# EasyEDA Pro project ProPrj_HEMY 2.0_2025-04-23.epro, schematic HEMY Redux v2.6.5M

## Sheets
1 Logic: Board Name: TeenAstro Redux v2.6.5M; Create Date: 2025-04-08; Page Name: Logic; Project Name: HEMY 2.0; Schematic Name: Redux v2.6.5M; Update Date: 2025-04-08; Company: zUrp Astronomics; Drawed: lordzurp / polvinc; Page Size: A4; Part Number: Main Board; Reviewed: polvinc / dgedgedge; Version: v2.6.5M
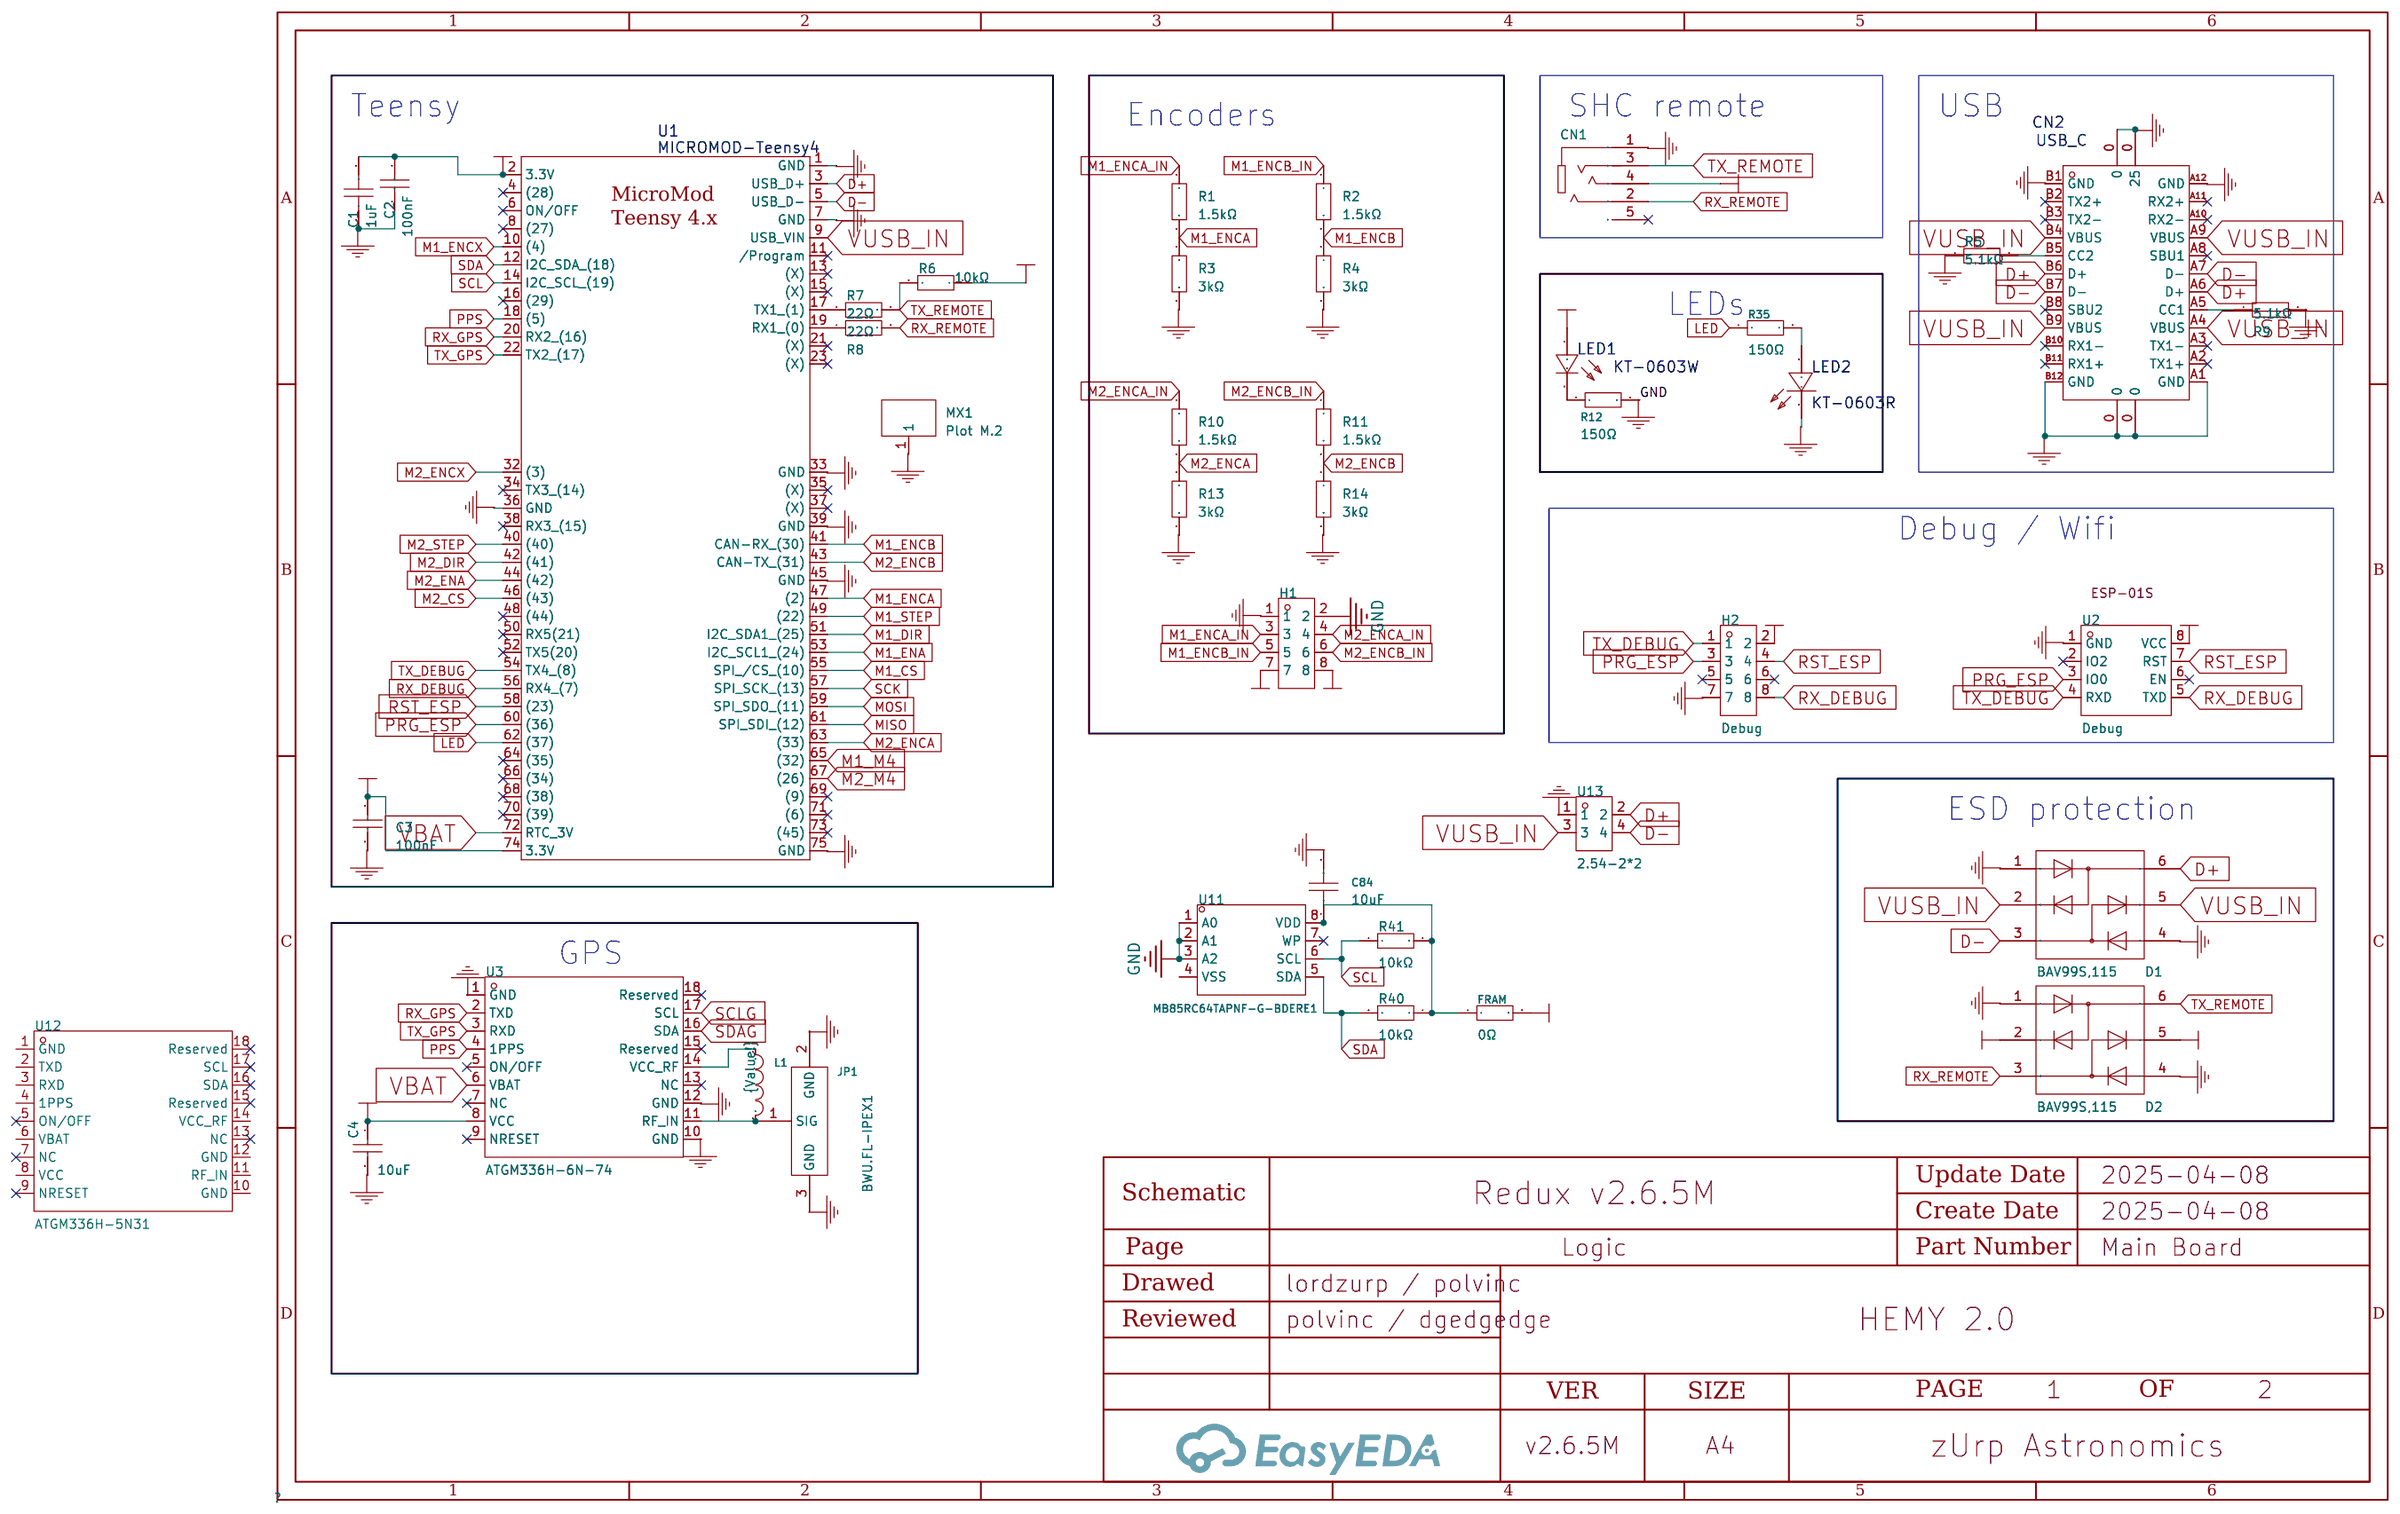
[diagram p0: Logic]
2 Power: Page Name: Power
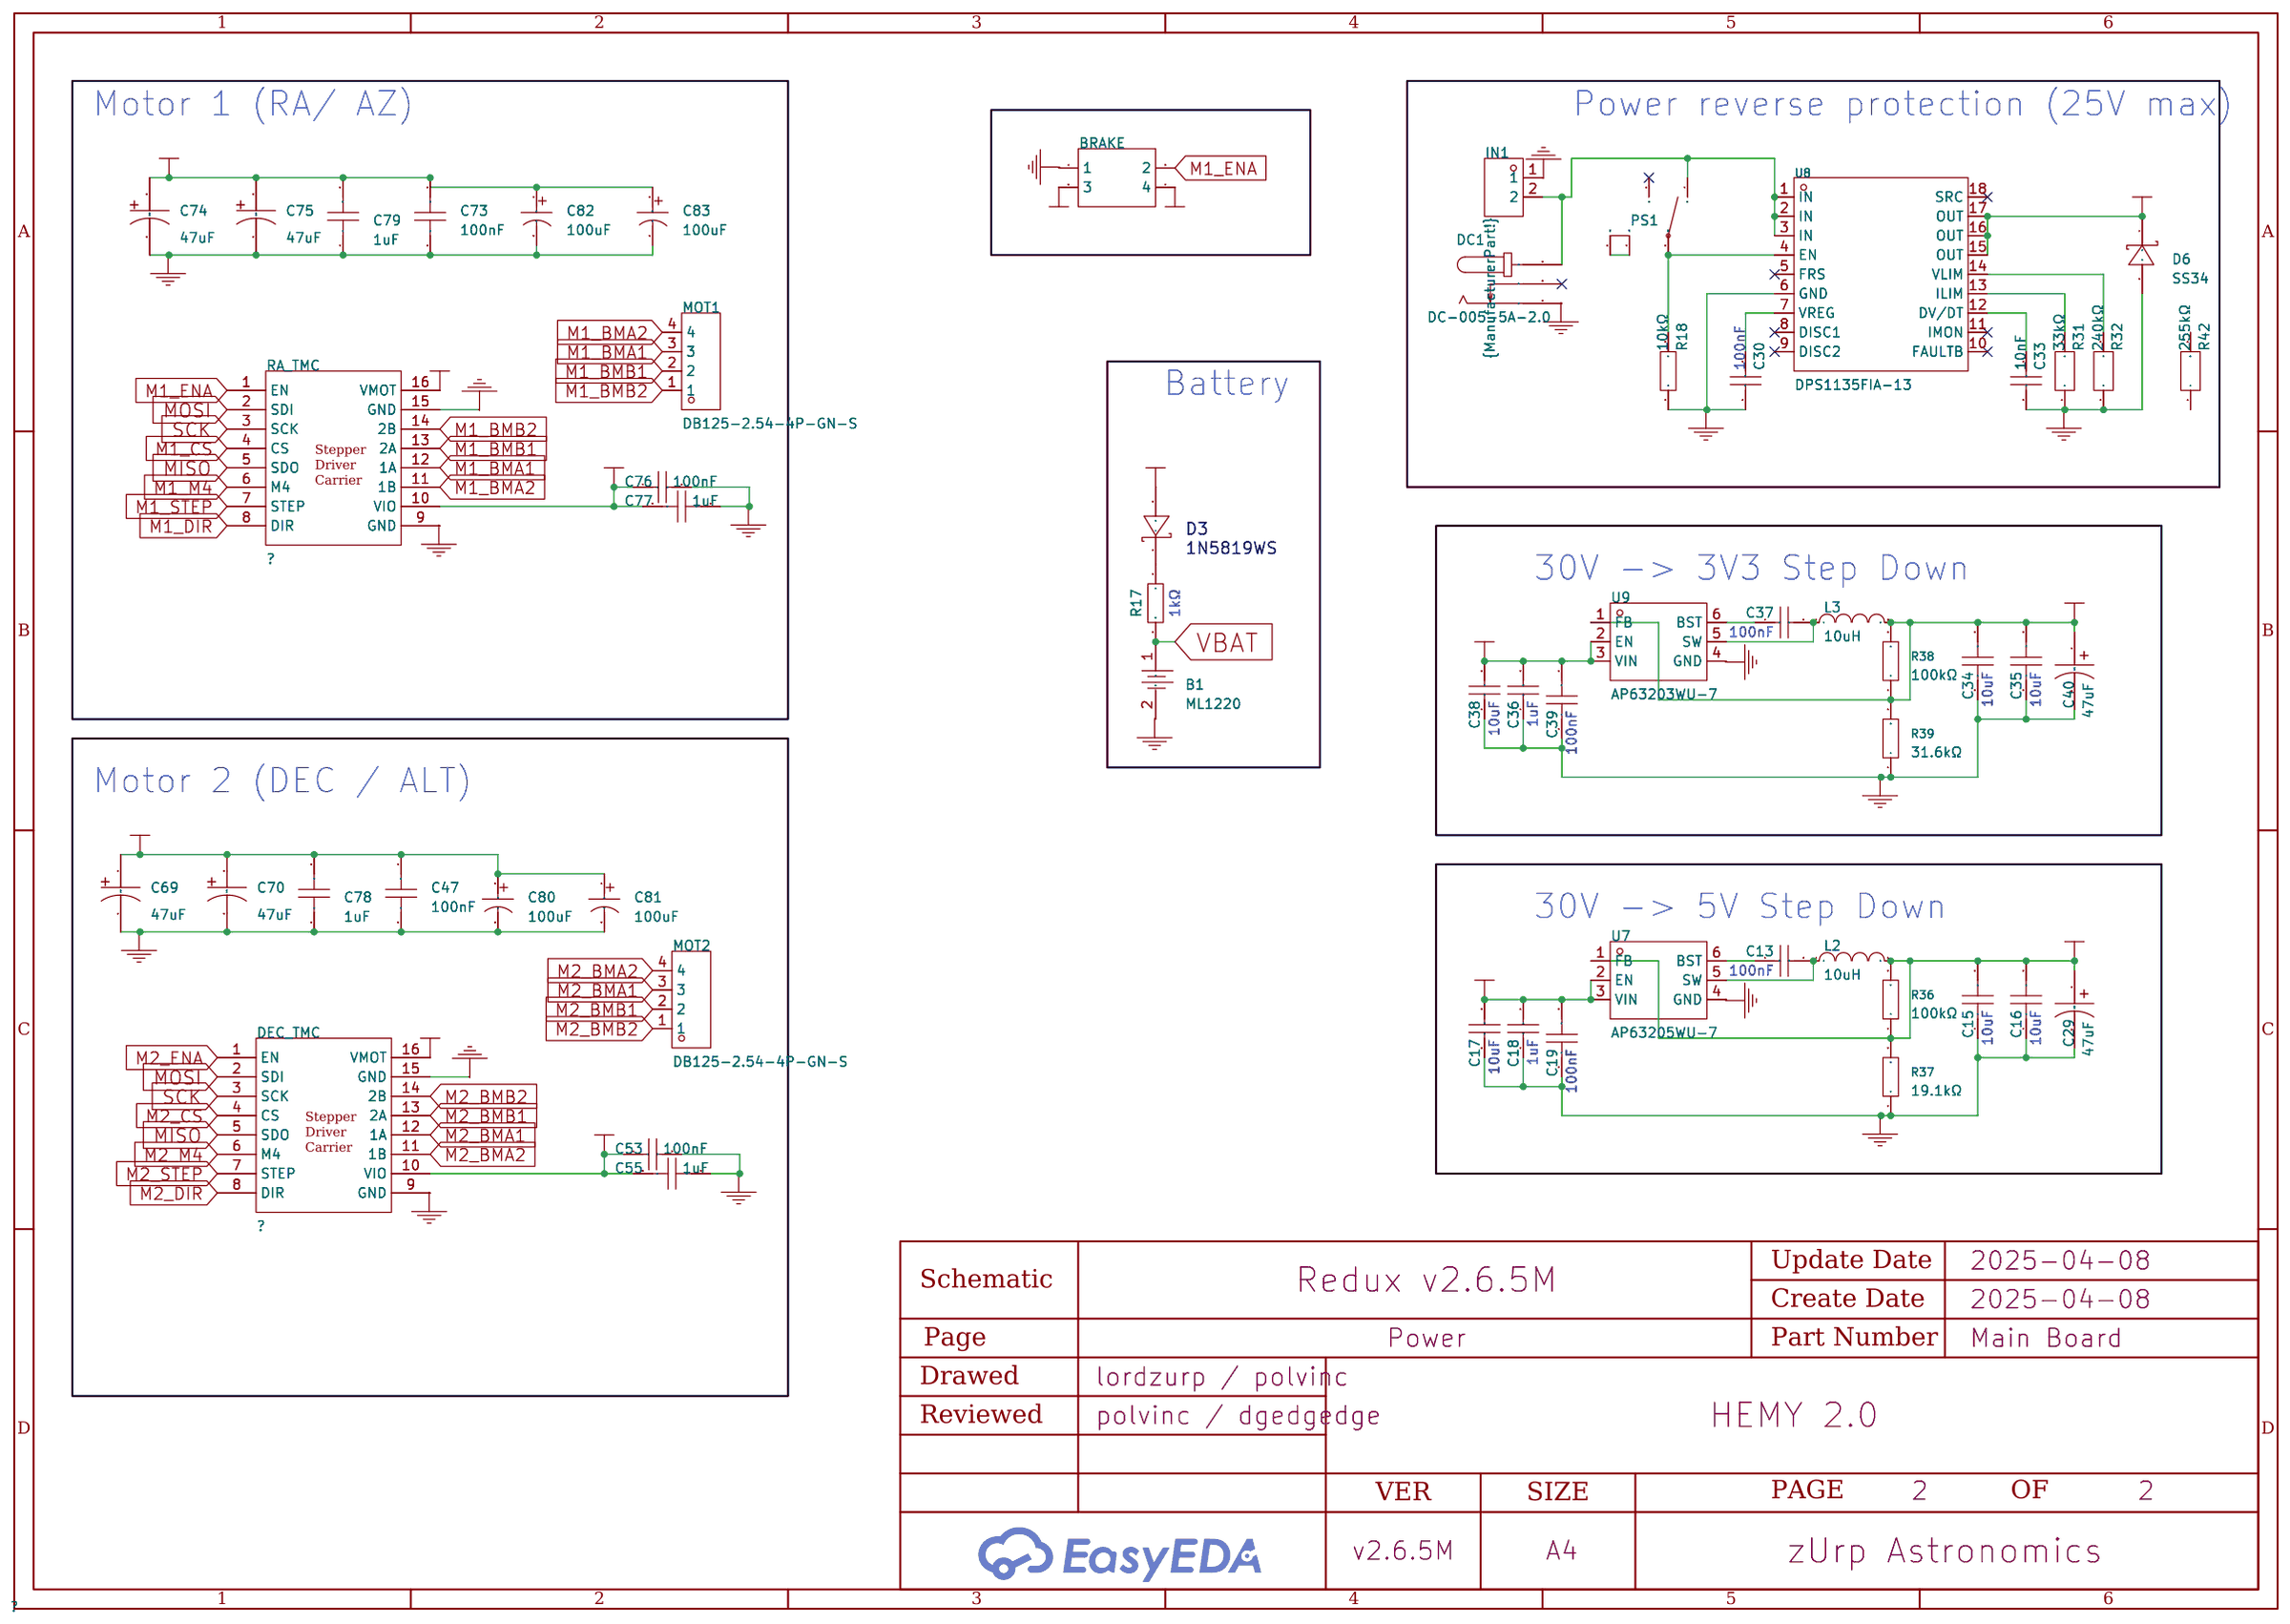
[diagram p1: Power]

## Parts
sheet Logic
C1  1uF  [C0402]
C2  100nF  [C0402]
C3  100nF  [C0402]
C4  10uF  [C0603]
C84  10uF  [C0603]
CN1  PJ-327E-SMT  [AUDIO-SMD_PJ-327E-SMT]
CN2  USB_C  [USB-C-SMD_TYPE-C-USB-18]
D1  BAV99S,115  [SOT-363_L2.0-W1.3-P0.65-LS2.1-TL]
D2  BAV99S,115  [SOT-363_L2.0-W1.3-P0.65-LS2.1-TL]
FRAM  0Ω  [R0402]
H1  DW127R-22-08-34  [HDR-TH_8P-P1.27-V-F-R2-C4-S1.27]  (no BOM)
H2  Debug  [HDR-TH_8P-P2.54-V-F-R2-C4-S2.54]  (no BOM)
JP1  BWU.FL-IPEX1  [IPEX-SMD_BWIPX-1-001E]
L1  -  [IND-SMD_L1.6-W0.8-1]
LED1  KT-0603W  [LED0603-R-RD_WHITE]
LED2  KT-0603R  [LED0603-RD]
MX1  Plot M.2  [SMD_BD5.6-D4.1]
R1  1.5kΩ  [R0603]
R2  1.5kΩ  [R0603]
R3  3kΩ  [R0603]
R4  3kΩ  [R0603]
R5  5.1kΩ  [R0603]
R6  10kΩ  [R0402]
R7  22Ω  [R0402]
R8  22Ω  [R0402]
R9  5.1kΩ  [R0603]
R10  1.5kΩ  [R0603]
R11  1.5kΩ  [R0603]
R12  150Ω  [R0603]
R13  3kΩ  [R0603]
R14  3kΩ  [R0603]
R35  150Ω  [R0603]
R40  10kΩ  [R0402]
R41  10kΩ  [R0402]
U1  MICROMOD-Teensy4  [M.2-CONNECTOR-E]
U2  2.4GHz  [WIFIM-TH_8P-L24.7-W14.4-P2.54]  (no BOM)
U3  ATGM336H-6N-74  [COMM-SMD_18P-L10.1-W9.7-P1.1-TL_L76-LB]
U11  MB85RC64TAPNF-G-BDERE1  [SOP-8_L5.0-W4.0-P1.27-LS6.0-BL]
U12  ATGM336H-5N31  [GPSM-SMD_ATGM336H-TR]  (no BOM)
U13  2.54-2*2  [HDR-TH_4P-P2.54-V-F-R2-C2-S2.54]  (no BOM)
sheet Power
B1  ML1220  [BAT-SMD_CR1220-2]  (no BOM)
BRAKE  X4621WVS-2x02I-C40D64  [HDR-SMD_4P-P2.00-V-M-R2-C2-S2.0]
C13  100nF  [C0402]
C15  10uF  [C0805]
C16  10uF  [C0805]
C17  10uF  [C1206]
C18  1uF  [C0805]
C19  100nF  [C0603]
C29  47uF  [CAP-SMD_L3.2-W1.6]
C30  100nF  [C0402]
C33  10nF  [C0402]
C34  10uF  [C0805]
C35  10uF  [C0805]
C36  1uF  [C0805]
C37  100nF  [C0402]
C38  10uF  [C1206]
C39  100nF  [C0603]
C40  47uF  [CAP-SMD_L3.2-W1.6]
C47  100nF  [C0603]
C53  100nF  [C0402]
C55  1uF  [C0402]
C69  47uF  [CAP-SMD_BD5.0-L5.3-W5.3-FD]  (no BOM)
C70  47uF  [CAP-SMD_BD5.0-L5.3-W5.3-FD]  (no BOM)
C73  100nF  [C0603]
C74  47uF  [CAP-SMD_BD5.0-L5.3-W5.3-FD]  (no BOM)
C75  47uF  [CAP-SMD_BD5.0-L5.3-W5.3-FD]  (no BOM)
C76  100nF  [C0402]
C77  1uF  [C0402]
C78  1uF  [C0603]
C79  1uF  [C0603]
C80  100uF  [CAP-TH_BD5.0-P2.00-D0.8-FD]
C81  100uF  [CAP-TH_BD5.0-P2.00-D0.8-FD]
C82  100uF  [CAP-TH_BD5.0-P2.00-D0.8-FD]
C83  100uF  [CAP-TH_BD5.0-P2.00-D0.8-FD]
D3  1N5819WS  [SOD-323_L1.8-W1.3-LS2.5-RD]
D6  SS34  [SMA_L4.3-W2.6-LS5.2-RD]
DC1  DC-005-5A-2.0  [DC-IN-TH_DC-005-5A-2.0]  (no BOM)
DEC_TMC  ?  [TMC2130 STEPPER MOTOR DRIVER CARRIER]  (no BOM)
IN1  -  [HDR-TH_2P-P2.54-V-M]  (no BOM)
L2  10uH  [IND-SMD_L2.5-W2.0_SWPA252012S]
L3  10uH  [IND-SMD_L2.5-W2.0_SWPA252012S]
MOT1  DB125-2.54-4P-GN-S  [CONN-TH_DB125-2.54-4P-GN]  (no BOM)
MOT2  DB125-2.54-4P-GN-S  [CONN-TH_DB125-2.54-4P-GN]  (no BOM)
PS1  -  [Power_switch]  (no BOM)
R17  1kΩ  [R0402]
R18  10kΩ  [R0402]
R31  33kΩ  [R0603]
R32  240kΩ  [R0603]
R36  100kΩ  [R0402]  (no BOM)
R37  19.1kΩ  [R0603]  (no BOM)
R38  100kΩ  [R0402]  (no BOM)
R39  31.6kΩ  [R0603]  (no BOM)
R42  255kΩ  [R0603]  (no BOM)
RA_TMC  ?  [TMC2130 STEPPER MOTOR DRIVER CARRIER]  (no BOM)
U7  AP63205WU-7  [TSOT-23-6_L2.9-W1.6-P0.95-LS2.8-BL]
U8  DPS1135FIA-13  [QFN-17_L4.0-W4.0-P0.50-TL-EP]
U9  AP63203WU-7  [TSOT-26_L2.9-W1.6-P0.95-LS2.8-BL]

## Library data of the parts
C1 C55 C77 = CL05A105KA5NQNC: Capacitance: Tolerance:±10% Tolerance:±10% Voltage Rated: Temperature Coefficient:; LCSC Part Name: 1uF ±10% 25V; Supplier Part: C52923; Manufacturer: SAMSUNG(三星); Supplier Footprint: 0402; JLCPCB Part Class: Basic Part; Datasheet: https://atta.szlcsc.com/upload/public/pdf/source/20160218/1457707763339.pdf; Supplier: LCSC; Tolerance: ±10%; Check: true
C2 C3 = CL05B104KO5NNNC: Capacitance: Tolerance:±10% Tolerance:±10% Voltage Rated: Temperature Coefficient:; LCSC Part Name: 100nF ±10% 16V; Supplier Part: C1525; Manufacturer: SAMSUNG(三星); Supplier Footprint: 0402; JLCPCB Part Class: Basic Part; Datasheet: https://atta.szlcsc.com/upload/public/pdf/source/20160218/1457707763339.pdf; Supplier: LCSC; Tolerance: ±10%; Check: true
C4 = GRM188R6YA106MA73D: Capacitance: Tolerance:±20% Tolerance:±20% Voltage Rated: Temperature Coefficient:; LCSC Part Name: 10uF ±20% 35V; Supplier Part: C194427; Manufacturer: muRata(村田); Supplier Footprint: 0603; JLCPCB Part Class: Extended Part; Datasheet: https://atta.szlcsc.com/upload/public/pdf/source/20210128/C194427_FCA3640823207DDB58700A82F1A19B5F.pdf; Supplier: LCSC; Tolerance: ±20%
C84 = CL10A106KP8NNNC: Capacitance: Tolerance:±10% Tolerance:±10% Voltage Rated: Temperature Coefficient:; LCSC Part Name: 10uF±10%10V; Supplier Part: C19702; Manufacturer: SAMSUNG(三星); Supplier Footprint: 0603; JLCPCB Part Class: BasicPart; Datasheet: https://atta.szlcsc.com/upload/public/pdf/source/20160103/1457707703378.pdf; Supplier: LCSC; Tolerance: ±10%
CN1 = PJ-327E-SMT: Connector Type:3.5mm耳机座 Current Rating (Max):0.5A Voltage Rating (Max):12V Operating Temperature Range:-20~+70 Operating Temperature Range:-20~+70 Welding Temperature (Max):235; LCSC Part Name: 3.5mm耳机座5P; Supplier Part: C319105; Manufacturer: XKBConnectivity(中国星坤); Supplier Footprint: SMD; JLCPCB Part Class: ExtendedPart; Datasheet: https://atta.szlcsc.com/upload/public/pdf/source/20211015/5335F6344674457D7BC015F82D74A0C2.pdf; Supplier: LCSC; Connector Type: 3.5mm耳机座; Current Rating (Max): 0.5A; Voltage Rating (Max): 12V; Operating Temperature Range: -20~+70; Welding Temperature (Max): 235; Check: true
CN2 = USB_C: JLCPCB Part Class: ExtendedPart; link: https://item.szlcsc.com/145400.html; Manufacturer: MOLEX; Manufacturer Part: 105450-0101; Supplier: LCSC; Supplier Part: C134092; Check: true
D1 D2 = BAV99S,115: Supplier Part: C96225; Manufacturer: Nexperia(安世); Supplier Footprint: SOT-363; JLCPCB Part Class: ExtendedPart; Datasheet: https://atta.szlcsc.com/upload/public/pdf/source/20170225/1488010658895.pdf; Supplier: LCSC; Check: true
FRAM = 0402WGF0000TCE: Type:Thick Film Resistors Resistance: Tolerance:±1% Tolerance:±1% Power(Watts): Overload Voltage (Max): Temperature Coefficient:±800ppm/℃ Temperature Coefficient:±800ppm/℃ Operating Temperature Range:-55℃~+155℃ Operating Temperature Range:-55℃~+155℃; LCSC Part Name: 0Ω ±1% 62.5mW 厚膜电阻; Supplier Part: C17168; Manufacturer: UNI-ROYAL(厚声); Supplier Footprint: 0402; JLCPCB Part Class: Basic Part; Datasheet: https://atta.szlcsc.com/upload/public/pdf/source/20200306/C422600_1E6D84923E4A46A82E41ADD87F860B5C.pdf; Supplier: LCSC; Type: Thick Film Resistors; Tolerance: ±1%; Temperature Coefficient: ±800ppm/℃; Operating Temperature Range: -55℃~+155℃
H1 = DW127R-22-08-34: Holes Structure:2x4P Pitch:1.27mm Row Spacing:1.27mm Circular Hole / Square Hole:Square Holes Mounting Type:Straight Number of Rows:双排 Number of Holes:8P Current Rating (Max):1A Voltage Rating (Max):- Holes Direction:Top Insulation Height:3.4mm Operating; LCSC Part Name: 间距:1.27mm 2x4P 直插; Supplier Part: C2935882; Manufacturer: DEALON(德艺隆); Supplier Footprint: 插件,P=1.27mm; JLCPCB Part Class: Extended Part; Datasheet: https://atta.szlcsc.com/upload/public/pdf/source/20211231/9A20BFE7A6FFE397B10DA1D4F064396A.pdf; Supplier: LCSC; Holes Structure: 2x4P; Pitch: 1.27mm; Row Spacing: 1.27mm; Circular Hole / Square Hole: Square Holes; Mounting Type: Straight; Number of Rows: 双排; Number of Holes: 8P; Current Rating (Max): 1A; Holes Direction: Top; Insulation Height: 3.4mm
H2 = DS1023-2*4SF11: Holes Structure:2x4P Pitch:2.54mm Row Spacing:2.54mm Mounting Type:Straight Number of Rows:双排 Number of Holes:8P Insulation Height:- Contact Material:- Contact Plating:-; LCSC Part Name: 间距:2.54mm 2x4P 直插 黑色; Supplier Part: C92271; Manufacturer: CONNFLY; Supplier Footprint: 插件,P=2.54mm; JLCPCB Part Class: Extended Part; Datasheet: https://atta.szlcsc.com/upload/public/pdf/source/20170925/C132132_1506321659018990428.pdf; Supplier: LCSC; Holes Structure: 2x4P; Pitch: 2.54mm; Row Spacing: 2.54mm; Mounting Type: Straight; Number of Rows: 双排; Number of Holes: 8P
JP1 = BWU.FL-IPEX1: Connector Type:板端 Interface Type:内针 Number of Ports:1 Interface Diameter:2mm Interface Length/Height:1.25mm Frequency-Max:6GHz RF Series:IPEX Impedance:50Ω Style:- Contact Material:- Contact Plating:- Operating Temperature Range:- Operating Temperature Ra; LCSC Part Name: 内针 IPEX; Supplier Part: C5137195; Manufacturer: BAT WIRELESS(蝙蝠无线); Supplier Footprint: SMD; JLCPCB Part Class: Extended Part; Datasheet: https://atta.szlcsc.com/upload/public/pdf/source/20220815/058ABE525AAE400925F1A3839AB872AC.pdf; Supplier: LCSC; Connector Type: 板端; Interface Type: 内针; Number of Ports: 1; Interface Diameter: 2mm; Interface Length/Height: 1.25mm; Frequency-Max: 6GHz; RF Series: IPEX; Impedance: 50Ω
L1 = LQW18AN47NJ00D: Supplier Part: C98077; Manufacturer: muRata(村田); Supplier Footprint: 0603; JLCPCB Part Class: ExtendedPart; Datasheet: https://atta.szlcsc.com/upload/public/pdf/source/20180326/C77127_CBB089AEA7AD2ECBE76B6A055087DE79.pdf; Supplier: LCSC; Check: true
LED1 = KT-0603W: Emitted Color:White; LCSC Part Name: 0603 白灯 高亮; Supplier Part: C2290; Manufacturer: KENTO; Supplier Footprint: 0603; JLCPCB Part Class: Basic Part; Datasheet: https://atta.szlcsc.com/upload/public/pdf/source/20221101/4C23D5C85BA051E44A00B833D0A41468.pdf; Supplier: LCSC; Emitted Color: White; JLCPCB SMD: Yes; link: https://lcsc.com/product-detail/Light-Emitting-Diodes-LED_Hubei-KENTO-Elec-0603-Green_C12624.html; image: //image.lceda.cn/szlcsc/C72043.jpg; Check: true
LED2 = KT-0603R: Emitted Color:红灯 Diode Configuration:- Lens Color:- Dominant Wavelength:- Dominant Wavelength:- Peak Wavelength:- Color Temperature:- Color Temperature:- Forward Current:- Power Dissipation:- Viewing Angle:- Mounting Sytle:- Operating Temperature:-40℃~+85; LCSC Part Name: 0603 红灯 高亮; Supplier Part: C2286; Manufacturer: KENTO; Supplier Footprint: 0603; JLCPCB Part Class: Basic Part; Datasheet: https://atta.szlcsc.com/upload/public/pdf/source/20160616/1466072038404.pdf; Supplier: LCSC; Emitted Color: 红灯; Operating Temperature: -40℃~+85℃; link: https://lcsc.com/product-detail/Light-Emitting-Diodes-LED_Hubei-KENTO-Elec-0603-Green_C12624.html; Check: true
MX1 = SMTSO3030CTJ: LCSC Part Name: M3贴片螺母铜镀锡铜镀锡; Supplier Part: C2915308; Manufacturer: Sinhoo(雄和远景); Supplier Footprint: M3x5.56xL3+1.53; JLCPCB Part Class: ExtendedPart; Datasheet: https://atta.szlcsc.com/upload/public/pdf/source/20211122/17CF5E24EB4D4DC090A80DE3D7DE5E21.pdf; Supplier: LCSC; Check: true
R1 R2 R10 R11 = 0603WAF1501T5E: Type:Thick Film Resistors Resistance: Tolerance:±1% Tolerance:±1% Power(Watts): Temperature Coefficient:±100ppm/℃ Temperature Coefficient:±100ppm/℃ Overload Voltage (Max): Operating Temperature Range:-55℃~+155℃ Operating Temperature Range:-55℃~+155℃; LCSC Part Name: 1.5kΩ±1%100mW; Supplier Part: C22843; Manufacturer: UNI-ROYAL(厚声); Supplier Footprint: 0603; JLCPCB Part Class: BasicPart; Datasheet: https://atta.szlcsc.com/upload/public/pdf/source/20200306/C422600_1E6D84923E4A46A82E41ADD87F860B5C.pdf; Supplier: LCSC; Type: ThickFilmResistors; Tolerance: ±1%; Temperature Coefficient: ±100ppm/℃; Operating Temperature Range: -55℃~+155℃; Check: true
R3 R4 R13 R14 = 0603WAF3001T5E: Type:Thick Film Resistors Resistance: Tolerance:±1% Tolerance:±1% Power(Watts): Temperature Coefficient:±100ppm/℃ Temperature Coefficient:±100ppm/℃ Overload Voltage (Max): Operating Temperature Range:-55℃~+155℃ Operating Temperature Range:-55℃~+155℃; LCSC Part Name: 3kΩ±1%100mW; Supplier Part: C4211; Manufacturer: UNI-ROYAL(厚声); Supplier Footprint: 0603; JLCPCB Part Class: BasicPart; Datasheet: https://atta.szlcsc.com/upload/public/pdf/source/20200306/C422600_1E6D84923E4A46A82E41ADD87F860B5C.pdf; Supplier: LCSC; Type: ThickFilmResistors; Tolerance: ±1%; Temperature Coefficient: ±100ppm/℃; Operating Temperature Range: -55℃~+155℃; Check: true
R5 R9 = 0603WAF5101T5E: Type:Thick Film Resistors Resistance:5.1kΩ Tolerance:±1% Tolerance:±1% Power(Watts): Overload Voltage (Max): Temperature Coefficient:±100ppm/℃ Temperature Coefficient:±100ppm/℃ Operating Temperature Range:-55℃~+155℃ Operating Temperature Range:-55℃~+155℃; LCSC Part Name: 5.1kΩ ±1% 100mW 厚膜电阻; Supplier Part: C23186; Manufacturer: UNI-ROYAL(厚声); Supplier Footprint: 0603; JLCPCB Part Class: Basic Part; Datasheet: https://atta.szlcsc.com/upload/public/pdf/source/20200306/C422600_1E6D84923E4A46A82E41ADD87F860B5C.pdf; Supplier: LCSC; Type: Thick Film Resistors; Tolerance: ±1%; Temperature Coefficient: ±100ppm/℃; Operating Temperature Range: -55℃~+155℃; Check: true
R6 = 0402WGF1002TCE: Type:Thick Film Resistors Resistance:10kΩ Tolerance:±1% Tolerance:±1% Power(Watts): Overload Voltage (Max): Temperature Coefficient:±100ppm/℃ Temperature Coefficient:±100ppm/℃ Operating Temperature Range:-55℃~+155℃ Operating Temperature Range:-55℃~+155℃; LCSC Part Name: 10kΩ ±1% 62.5mW 厚膜电阻; Supplier Part: C25744; Manufacturer: UNI-ROYAL(厚声); Supplier Footprint: 0402; JLCPCB Part Class: Basic Part; Datasheet: https://atta.szlcsc.com/upload/public/pdf/source/20200306/C422600_1E6D84923E4A46A82E41ADD87F860B5C.pdf; Supplier: LCSC; Type: Thick Film Resistors; Tolerance: ±1%; Temperature Coefficient: ±100ppm/℃; Operating Temperature Range: -55℃~+155℃; Check: true
R7 R8 = 0402WGF220JTCE: Type:Thick Film Resistors Resistance:22Ω Tolerance:±1% Tolerance:±1% Power(Watts): Overload Voltage (Max): Temperature Coefficient:±100ppm/℃ Temperature Coefficient:±100ppm/℃ Operating Temperature Range:-55℃~+155℃ Operating Temperature Range:-55℃~+155℃; LCSC Part Name: 22Ω ±1% 62.5mW 厚膜电阻; Supplier Part: C25092; Manufacturer: UNI-ROYAL(厚声); Supplier Footprint: 0402; JLCPCB Part Class: Basic Part; Datasheet: https://atta.szlcsc.com/upload/public/pdf/source/20200306/C422600_1E6D84923E4A46A82E41ADD87F860B5C.pdf; Supplier: LCSC; Type: Thick Film Resistors; Tolerance: ±1%; Temperature Coefficient: ±100ppm/℃; Operating Temperature Range: -55℃~+155℃; Check: true
R12 R35 = 0603WAF1500T5E: Type:Thick Film Resistors Resistance: Tolerance:±1% Tolerance:±1% Power(Watts): Overload Voltage (Max): Temperature Coefficient:±100ppm/℃ Temperature Coefficient:±100ppm/℃ Operating Temperature Range:-55℃~+155℃ Operating Temperature Range:-55℃~+155℃; LCSC Part Name: 150Ω ±1% 100mW 厚膜电阻; Supplier Part: C22808; Manufacturer: UNI-ROYAL(厚声); Supplier Footprint: 0603; JLCPCB Part Class: Basic Part; Datasheet: https://atta.szlcsc.com/upload/public/pdf/source/20200306/C422600_1E6D84923E4A46A82E41ADD87F860B5C.pdf; Supplier: LCSC; Type: Thick Film Resistors; Tolerance: ±1%; Temperature Coefficient: ±100ppm/℃; Operating Temperature Range: -55℃~+155℃
R18 R40 R41 = 0402WGF1002TCE: Type:Thick Film Resistors Resistance:10kΩ Tolerance:±1% Tolerance:±1% Power(Watts): Overload Voltage (Max): Temperature Coefficient:±100ppm/℃ Temperature Coefficient:±100ppm/℃ Operating Temperature Range:-55℃~+155℃ Operating Temperature Range:-55℃~+155℃; LCSC Part Name: 10kΩ ±1% 62.5mW 厚膜电阻; Supplier Part: C25744; Manufacturer: UNI-ROYAL(厚声); Supplier Footprint: 0402; JLCPCB Part Class: BasicPart; Datasheet: https://atta.szlcsc.com/upload/public/pdf/source/20200306/C422600_1E6D84923E4A46A82E41ADD87F860B5C.pdf; Supplier: LCSC; Type: ThickFilmResistors; Tolerance: ±1%; Temperature Coefficient: ±100ppm/℃; Operating Temperature Range: -55℃~+155℃; Check: true
U1 = MICROMOD-Teensy4: Manufacturer: Foxconn; Manufacturer Part: AS0BC21-S48BE-7H; Supplier: LCSC; Supplier Part: C2761457; Check: true
U2 = ESP-01: Frequency:2.4GHz Output Power:16dBm Output Power:16dBm Core Processor:ESP32 Support Interface:GPIO；UART Antenna Type:板载 PCB Antenna/IPEX Antenna Wireless Standard:802.11b/g/n Operating Voltage:3V~3.6V Operating Voltage:3V~3.6V Receive  Current:- Send  Cur; LCSC Part Name: 体积超小的802.11b/g/nWi-FiSOC模块; Supplier Part: C503581; Manufacturer: Ai-Thinker(安信可); Manufacturer Part: ESP-01S; JLCPCB Part Class: ExtendedPart; Datasheet: https://atta.szlcsc.com/upload/public/pdf/source/20200407/C503581_BFDAA19F4B592DB0CEE4D61B6918C625.pdf; Supplier: LCSC; Output Power: 16dBm; Core Processor: ESP32; Support Interface: GPIO；UART; Antenna Type: 板载PCBAntenna/IPEXAntenna; Wireless Standard: 802.11b/g/n; Operating Voltage: 3V~3.6V; Sensitivity: -90dBm; Operating Temperature: -20℃~+85℃; Check: true
U3 = ATGM336H-6N-74: Supplier Part: C5804601; Manufacturer: 杭州中科微; Supplier Footprint: SMD,10.1x9.7mm; JLCPCB Part Class: Extended Part; Datasheet: https://atta.szlcsc.com/upload/public/pdf/source/20230620/6B4557DC589EF72A5E0A00DF964910CB.pdf; Supplier: LCSC
U11 = MB85RC64TAPNF-G-BDERE1: Supplier Part: C189804; Manufacturer: RAMXEED/FUJITSU(富士通); Supplier Footprint: SOP-8; JLCPCB Part Class: Extended Part; Datasheet: https://atta.szlcsc.com/upload/public/pdf/source/20180403/C189905_A8E0CA722DC8D83A10C1D27357EA684E.pdf; Supplier: LCSC
U12 = ATGM336H-5N31: LCSC Part Name: BDS/GNSS全星座定位导航模块; Supplier Part: C90770; Manufacturer: 杭州中科微; Supplier Footprint: SMD,9.7x10.1mm; JLCPCB Part Class: ExtendedPart; Datasheet: https://atta.szlcsc.com/upload/public/pdf/source/20161226/1482720799860.pdf; Supplier: LCSC; Check: true
U13 = 2.54-2*2: Holes Structure:2x2P Pitch:2.54mm Row Spacing:2.54mm Circular Hole / Square Hole:Square Holes Mounting Type:Straight Number of Rows:双排 Number of Holes:4P Current Rating (Max):2.5A Voltage Rating (Max):- Holes Direction:Top Insulation Height:8.5mm Operatin; LCSC Part Name: 间距:2.54mm 2x2P 直插; Supplier Part: C2977590; Manufacturer: ZHOURI(洲日); Supplier Footprint: 插件,P=2.54mm; JLCPCB Part Class: Extended Part; Datasheet: https://atta.szlcsc.com/upload/public/pdf/source/20220328/0DEB63D734370D90CA736158671615A0.pdf; Supplier: LCSC; Holes Structure: 2x2P; Pitch: 2.54mm; Row Spacing: 2.54mm; Circular Hole / Square Hole: Square Holes; Mounting Type: Straight; Number of Rows: 双排; Number of Holes: 4P; Current Rating (Max): 2.5A; Holes Direction: Top; Insulation Height: 8.5mm; Operating Temperature Range: -40℃~+105℃
B1 = CR1220-2: Connector Type:Battery base Battery Type:CR1220 Operating Temperature Range:- Operating Temperature Range:-; LCSC Part Name: 电池底座适用电池:CR1220; Supplier Part: C70381; Manufacturer: Q&J; Supplier Footprint: SMD; JLCPCB Part Class: ExtendedPart; Datasheet: https://atta.szlcsc.com/upload/public/pdf/source/20160427/1461725216696.pdf; Supplier: LCSC; Connector Type: Batterybase; Battery Type: CR1220; Check: true
BRAKE = X4621WVS-2x02I-C40D64: Pin Structure:2x2P Pitch:2mm Row Spacing:2mm Circluar Pins/Square Pins:Square Pins Mounting Type:- Number of Rows:双排 Number of Pins:4P Current Rating (Max):2A Voltage Rating (Max):250V Length of Mating Pin:- Insulation Height:2mm Length of End Connection; LCSC Part Name: 2x2P 间距:2mm 方针; Supplier Part: C917607; Manufacturer: XKB Connection(中国星坤); Supplier Footprint: SMD,P=2mm; JLCPCB Part Class: Extended Part; Datasheet: https://atta.szlcsc.com/upload/public/pdf/source/20211011/BBC0D112400A54BA7413419DECD38CC2.pdf; Supplier: LCSC; Pin Structure: 2x2P; Pitch: 2mm; Row Spacing: 2mm; Circluar Pins/Square Pins: Square Pins; Number of Rows: 双排; Number of Pins: 4P; Current Rating (Max): 2A; Voltage Rating (Max): 250V; Insulation Height: 2mm; Contact Plating: Gold; Operating Temperature Range: -40℃~+105℃; Soldering Temperature(Max): 260℃; Color: Black
C13 C30 C37 C53 C76 = CL05B104KO5NNNC: Capacitance: Tolerance:±10% Tolerance:±10% Voltage Rated: Temperature Coefficient:; LCSC Part Name: 100nF±10%16V; Supplier Part: C1525; Manufacturer: SAMSUNG(三星); Supplier Footprint: 0402; JLCPCB Part Class: BasicPart; Datasheet: https://atta.szlcsc.com/upload/public/pdf/source/20160218/1457707763339.pdf; Supplier: LCSC; Tolerance: ±10%; Check: true
C15 C16 C34 C35 = CL21A106KAYNNNE_C15850: Capacitance: Tolerance:±10% Tolerance:±10% Voltage Rated: Temperature Coefficient:; LCSC Part Name: 10uF ±10% 25V; Supplier Part: C15850; Manufacturer: SAMSUNG(三星); Manufacturer Part: CL21A106KAYNNNE; Supplier Footprint: 0805; JLCPCB Part Class: Basic Part; Datasheet: https://atta.szlcsc.com/upload/public/pdf/source/20160218/1457707763339.pdf; Supplier: LCSC; Tolerance: ±10%
C17 C38 = CL31A106KBHNNNE: Capacitance: Tolerance:±10% Tolerance:±10% Voltage Rated: Temperature Coefficient:; LCSC Part Name: 10uF ±10% 50V; Supplier Part: C13585; Manufacturer: SAMSUNG(三星); Supplier Footprint: 1206; JLCPCB Part Class: Basic Part; Datasheet: https://atta.szlcsc.com/upload/public/pdf/source/20160218/1457707763339.pdf; Supplier: LCSC; Tolerance: ±10%; Check: true
C18 C36 = CL21B105KBFNNNE: Capacitance: Tolerance:±10% Tolerance:±10% Voltage Rated: Temperature Coefficient:; LCSC Part Name: 1uF ±10% 50V; Supplier Part: C28323; Manufacturer: SAMSUNG(三星); Supplier Footprint: 0805; JLCPCB Part Class: Basic Part; Datasheet: https://atta.szlcsc.com/upload/public/pdf/source/20160218/1457707763339.pdf; Supplier: LCSC; Tolerance: ±10%; Check: true
C19 C39 C47 C73 = CC0603KRX7R9BB104: Capacitance: Tolerance:±10% Tolerance:±10% Voltage Rated: Temperature Coefficient:; LCSC Part Name: 100nF±10%50V; Supplier Part: C14663; Manufacturer: YAGEO(国巨); Supplier Footprint: 0603; JLCPCB Part Class: BasicPart; Datasheet: https://atta.szlcsc.com/upload/public/pdf/source/20180910/C282072_33301C7F631E79921B82A8DAC6BCC5B3.pdf; Supplier: LCSC; Tolerance: ±10%; Check: true
C29 C40 = CA45-A-10V-47uF-M: Capacitance: Tolerance:±20% Tolerance:±20% Rated Voltage: Equivalent Series Resistance(ESR):4Ω@100kHz Operating Temperature:-55℃~+125℃ Operating Temperature:-55℃~+125℃; LCSC Part Name: 47uF ±20% 10V; Supplier Part: C688949; Manufacturer: CEC(振华新云); Supplier Footprint: CASE-A-3216; JLCPCB Part Class: Extended Part; Datasheet: https://atta.szlcsc.com/upload/public/pdf/source/20200701/C688947_CFA6E56082A981E438B337581FD21AD9.pdf; Supplier: LCSC; Tolerance: ±20%; Equivalent Series Resistance(ESR): 4Ω@100kHz; Operating Temperature: -55℃~+125℃
C33 = CL05B103KB5NNNC: Capacitance: Tolerance:±10% Tolerance:±10% Voltage Rated: Temperature Coefficient:; LCSC Part Name: 10nF ±10% 50V; Supplier Part: C15195; Manufacturer: SAMSUNG(三星); Supplier Footprint: 0402; JLCPCB Part Class: Basic Part; Datasheet: https://atta.szlcsc.com/upload/public/pdf/source/20160218/1457707763339.pdf; Supplier: LCSC; Tolerance: ±10%
C69 C70 C74 C75 = EEEFT1V470AR_C193627: Capacitance: Tolerance:±20% Tolerance:±20% Rated Voltage: Ripple Current:240mA@100kHz Equivalent Series Resistance(ESR):360mΩ@100kHz φD: L: Lifetime @ Temp:2000hrs@105℃ Operating Temperature:-55℃~+105℃ Operating Temperature:-55℃~+105℃; LCSC Part Name: 47uF ±20% 35V; Supplier Part: C193627; Manufacturer: PANASONIC(松下); Manufacturer Part: EEEFT1V470AR; Supplier Footprint: SMD,D5xL5.8mm; JLCPCB Part Class: Extended Part; Datasheet: https://atta.szlcsc.com/upload/public/pdf/source/20180607/C193627_6FE5DFF204FFC953F0DC145BA6F69CE8.pdf; Supplier: LCSC; Tolerance: ±20%; Ripple Current: 240mA@100kHz; Equivalent Series Resistance(ESR): 360mΩ@100kHz; Lifetime @ Temp: 2000hrs@105℃; Operating Temperature: -55℃~+105℃
C78 C79 = CGA0603X5R105K350JT: Capacitance:1uF Tolerance:±10% Tolerance:±10% Voltage Rated: Temperature Coefficient:; LCSC Part Name: 1uF ±10% 35V; Supplier Part: C6119865; Manufacturer: HRE(芯声); Supplier Footprint: 0603; JLCPCB Part Class: Extended Part; Supplier: LCSC; Tolerance: ±10%
C80-C83 = KM107M025D11RR0VH2FP0: Capacitance:100uF Tolerance:±20% Tolerance:±20% Rated Voltage: Ripple Current:100mA@120Hz Equivalent Series Resistance(ESR):- Lead Spacing: φD: L: Lifetime @ Temp:1000hrs@105℃; LCSC Part Name: 100uF ±20% 25V; Supplier Part: C47873; Manufacturer: CX(承兴); Supplier Footprint: 插件,D5xL11mm; JLCPCB Part Class: Extended Part; Datasheet: https://atta.szlcsc.com/upload/public/pdf/source/20211027/06D6BA3719C264B639DC286D935D03EA.pdf; Supplier: LCSC; Tolerance: ±20%; Ripple Current: 100mA@120Hz; Lifetime @ Temp: 1000hrs@105℃
D3 = 1N5819WS_C191023: Forward Voltage (Vf@If):600mV@1A Reverse Voltage (Vr):40V Average Rectified Current (Io):1A; LCSC Part Name: 电压:40V 电流:1A; Supplier Part: C191023; Manufacturer: Hottech(合科泰); Supplier Footprint: SOD-323; JLCPCB Part Class: Basic Part; Datasheet: https://atta.szlcsc.com/upload/public/pdf/source/20220428/3CB86FD8D28D653594B4E35F9D5AEFD9.pdf; Supplier: LCSC; Forward Voltage (Vf@If): 600mV@1A; Reverse Voltage (Vr): 40V; Average Rectified Current (Io): 1A
D6 = SS34_C8678: Diode Configuration:Single Forward Voltage (Vf@If):550mV@3A Reverse Voltage (Vr):40V Rectified Current:3A Reverse Leakage Current (Ir):500uA@40V; LCSC Part Name: 电压:40V 电流:3A; Supplier Part: C8678; Manufacturer: MDD(辰达半导体); Supplier Footprint: SMA(DO-214AC); JLCPCB Part Class: Basic Part; Datasheet: https://atta.szlcsc.com/upload/public/pdf/source/20230314/A80AE34493C69B89E2F4B1712F433538.pdf; Supplier: LCSC; Diode Configuration: Single; Forward Voltage (Vf@If): 550mV@3A; Reverse Voltage (Vr): 40V; Rectified Current: 3A; Reverse Leakage Current (Ir): 500uA@40V
DC1 = DC-005-5A-2.0: Connector Type:DC Power Receptacle Mounting Style:Bend insert Inside Contact Diameter:2mm Outside Contact Diameter:6.2mm Current Rating (Max):5A Voltage Rating (Max):24V Operating Temperature Range:-20℃~+70℃ Operating Temperature Range:-20℃~+70℃; LCSC Part Name: DC电源插座 内径:2mm 外径:6.2mm; Supplier Part: C381116; Manufacturer: XKB Connection(中国星坤); Supplier Footprint: 插件; JLCPCB Part Class: Extended Part; Datasheet: https://atta.szlcsc.com/upload/public/pdf/source/20211015/707A35F7AB6E89C57AAB641950105BB7.pdf; Supplier: LCSC; Connector Type: DC Power Receptacle; Mounting Style: Bend insert; Inside Contact Diameter: 2mm; Outside Contact Diameter: 6.2mm; Current Rating (Max): 5A; Voltage Rating (Max): 24V; Operating Temperature Range: -20℃~+70℃
DEC_TMC RA_TMC = TMC2130 Stepper Motor Driver Carrier
IN1 = HEAD2: Supplier Part: C9900010030; Supplier Footprint: HDR-TH_2P-P2.54; JLCPCB Part Class: ExtendedPart; Datasheet: https://atta.szlcsc.comnull; Supplier: LCSC; Check: true
L2 L3 = SWPA252012S100MT: Inductance: Tolerance:±20% Tolerance:±20% Rated Current: Saturation Current (Isat):880mA DC Resistance (DCR): Type:- Ratings:-; LCSC Part Name: 10uH ±20% 880mA; Supplier Part: C37428; Manufacturer: Sunlord(顺络); Supplier Footprint: 1008; JLCPCB Part Class: Extended Part; Datasheet: https://atta.szlcsc.com/upload/public/pdf/source/20231024/317626D2AA2F8AB4113C1875E432E6E1.pdf; Supplier: LCSC; Tolerance: ±20%; Saturation Current (Isat): 880mA
MOT1 MOT2 = DB125-2.54-4P-GN-S: Structure:1x4P Pitch:2.54mm Color:Green Mounting Style:Straight Current Rating (Max):8A Voltage Rating (Max):130V Number of Pins:4P Number of Rows:1 Wire Gauge - AWG:18~26 Wire Gauge - AWG:18~26 Wire Gauge - mm2:0.5~1 Wire Gauge - mm2:0.5~1 Number of PINs; LCSC Part Name: 2.54mm 1x4P 排数:1 每排P数:4 直插; Supplier Part: C918122; Manufacturer: DORABO(地博电气); Supplier Footprint: 插件,P=2.54mm; JLCPCB Part Class: Extended Part; Datasheet: https://atta.szlcsc.com/upload/public/pdf/source/20230106/BCD3A0BE1EB95DC3E813F1745F022035.pdf; Supplier: LCSC; Structure: 1x4P; Pitch: 2.54mm; Color: Green; Mounting Style: Straight; Current Rating (Max): 8A; Voltage Rating (Max): 130V; Number of Pins: 4P; Number of Rows: 1; Wire Gauge - AWG: 18~26; Wire Gauge - mm2: 0.5~1; Number of PINs Per Row: 4; Operating Temperature Range: -40℃~+105℃
PS1 = Power_Switch: farnell 15502274US1R102M7RN; Manufacturer Part: 4US1R102M7RN; Manufacturer: MULTICOMP PRO; Supplier Part: 1550227; Supplier: Farnell; Check: true
R17 = 0402WGF1001TCE: Type:Thick Film Resistors Resistance:1kΩ Tolerance:±1% Tolerance:±1% Power(Watts): Overload Voltage (Max): Temperature Coefficient:±100ppm/℃ Temperature Coefficient:±100ppm/℃ Operating Temperature Range:-55℃~+155℃ Operating Temperature Range:-55℃~+155℃; LCSC Part Name: 1kΩ ±1% 62.5mW 厚膜电阻; Supplier Part: C11702; Manufacturer: UNI-ROYAL(厚声); Supplier Footprint: 0402; JLCPCB Part Class: Basic Part; Datasheet: https://atta.szlcsc.com/upload/public/pdf/source/20200306/C422600_1E6D84923E4A46A82E41ADD87F860B5C.pdf; Supplier: LCSC; Type: Thick Film Resistors; Tolerance: ±1%; Temperature Coefficient: ±100ppm/℃; Operating Temperature Range: -55℃~+155℃
R31 = 0603WAF3302T5E: Type:Thick Film Resistors Resistance:33kΩ Tolerance:±1% Tolerance:±1% Power(Watts): Overload Voltage (Max): Temperature Coefficient:±100ppm/℃ Temperature Coefficient:±100ppm/℃ Operating Temperature Range:-55℃~+155℃ Operating Temperature Range:-55℃~+155℃; LCSC Part Name: 33kΩ ±1% 100mW 厚膜电阻; Supplier Part: C4216; Manufacturer: UNI-ROYAL(厚声); Supplier Footprint: 0603; JLCPCB Part Class: Basic Part; Datasheet: https://atta.szlcsc.com/upload/public/pdf/source/20200306/C422600_1E6D84923E4A46A82E41ADD87F860B5C.pdf; Supplier: LCSC; Type: Thick Film Resistors; Tolerance: ±1%; Temperature Coefficient: ±100ppm/℃; Operating Temperature Range: -55℃~+155℃
R32 = 0603WAF2403T5E: Type:Thick Film Resistors Resistance:240kΩ Tolerance:±1% Tolerance:±1% Power(Watts): Overload Voltage (Max): Temperature Coefficient:±100ppm/℃ Temperature Coefficient:±100ppm/℃ Operating Temperature Range:-55℃~+155℃ Operating Temperature Range:-55℃~+155℃; LCSC Part Name: 240kΩ ±1% 100mW 厚膜电阻; Supplier Part: C4197; Manufacturer: UNI-ROYAL(厚声); Supplier Footprint: 0603; JLCPCB Part Class: Extended Part; Datasheet: https://atta.szlcsc.com/upload/public/pdf/source/20200306/C422600_1E6D84923E4A46A82E41ADD87F860B5C.pdf; Supplier: LCSC; Type: Thick Film Resistors; Tolerance: ±1%; Temperature Coefficient: ±100ppm/℃; Operating Temperature Range: -55℃~+155℃
R36 R38 = 0402WGF1003TCE: Type:Thick Film Resistors Resistance:100kΩ Tolerance:±1% Tolerance:±1% Power(Watts): Overload Voltage (Max): Temperature Coefficient:±100ppm/℃ Temperature Coefficient:±100ppm/℃ Operating Temperature Range:-55℃~+155℃ Operating Temperature Range:-55℃~+155℃; LCSC Part Name: 100kΩ ±1% 62.5mW 厚膜电阻; Supplier Part: C25741; Manufacturer: UNI-ROYAL(厚声); Supplier Footprint: 0402; JLCPCB Part Class: Basic Part; Datasheet: https://atta.szlcsc.com/upload/public/pdf/source/20200306/C422600_1E6D84923E4A46A82E41ADD87F860B5C.pdf; Supplier: LCSC; Type: Thick Film Resistors; Tolerance: ±1%; Temperature Coefficient: ±100ppm/℃; Operating Temperature Range: -55℃~+155℃
R37 = 0603WAF1912T5E: Type:Thick Film Resistors Resistance:19.1kΩ Tolerance:±1% Tolerance:±1% Power(Watts): Overload Voltage (Max): Temperature Coefficient:±100ppm/℃ Temperature Coefficient:±100ppm/℃ Operating Temperature Range:-55℃~+155℃ Operating Temperature Range:-55℃~+155℃; LCSC Part Name: 19.1kΩ ±1% 100mW 厚膜电阻; Supplier Part: C22897; Manufacturer: UNI-ROYAL(厚声); Supplier Footprint: 0603; JLCPCB Part Class: Extended Part; Datasheet: https://atta.szlcsc.com/upload/public/pdf/source/20200306/C422600_1E6D84923E4A46A82E41ADD87F860B5C.pdf; Supplier: LCSC; Type: Thick Film Resistors; Tolerance: ±1%; Temperature Coefficient: ±100ppm/℃; Operating Temperature Range: -55℃~+155℃
R39 = 0603WAF3162T5E: Type:Thick Film Resistors Resistance:31.6kΩ Tolerance:±1% Tolerance:±1% Power(Watts): Overload Voltage (Max): Temperature Coefficient:±100ppm/℃ Temperature Coefficient:±100ppm/℃ Operating Temperature Range:-55℃~+155℃ Operating Temperature Range:-55℃~+155℃; LCSC Part Name: 31.6kΩ ±1% 100mW 厚膜电阻; Supplier Part: C25967; Manufacturer: UNI-ROYAL(厚声); Supplier Footprint: 0603; JLCPCB Part Class: Extended Part; Datasheet: https://atta.szlcsc.com/upload/public/pdf/source/20200306/C422600_1E6D84923E4A46A82E41ADD87F860B5C.pdf; Supplier: LCSC; Type: Thick Film Resistors; Tolerance: ±1%; Temperature Coefficient: ±100ppm/℃; Operating Temperature Range: -55℃~+155℃
R42 = RC0603FR-07255KL_C295887: Type:Thick Film Resistors Resistance: Tolerance:±1% Tolerance:±1% Power(Watts): Overload Voltage (Max): Temperature Coefficient:±100ppm/℃ Temperature Coefficient:±100ppm/℃ Operating Temperature Range:-55℃~+155℃ Operating Temperature Range:-55℃~+155℃; LCSC Part Name: 厚膜电阻 255kΩ ±1% 100mW; Supplier Part: C295887; Manufacturer: YAGEO(国巨); Manufacturer Part: RC0603FR-07255KL; Supplier Footprint: 0603; JLCPCB Part Class: Extended Part; Datasheet: https://atta.szlcsc.com/upload/public/pdf/source/20191125/C364360_EA870FADD46A2AD4DBE56DD50D360B3E.pdf; Supplier: LCSC; Type: Thick Film Resistors; Tolerance: ±1%; Temperature Coefficient: ±100ppm/℃; Operating Temperature Range: -55℃~+155℃
U7 = AP63205WU-7: Function:Step-down type Output Type:Fixed Input Voltage:3.8V~32V Input Voltage:3.8V~32V Output Voltage:5V Output Voltage:5V Output Current (Max):2A Switching Frequency:1.1MHz Operating Temperature:-40℃~+85℃@(TA) Operating Temperature:-40℃~+85℃@(TA) Synchr; Supplier Part: C2071056; Manufacturer: DIODES(美台); Supplier Footprint: TSOT-23-6; JLCPCB Part Class: Extended Part; Datasheet: https://atta.szlcsc.com/upload/public/pdf/source/20210622/C780769_099C67289BD3EC61AAFB52D8B07125B3.pdf; Supplier: LCSC; Function: Step-down type; Output Type: Fixed; Input Voltage: 3.8V~32V; Output Voltage: 5V; Output Current (Max): 2A; Switching Frequency: 1.1MHz; Operating Temperature: -40℃~+85℃@(TA); Synchronous Rectification: Yes; Number of Outputs: 1; Topology: Step-down; Switch tube (built-in/external): 内置
U8 = DPS1135FIA-13: Supplier Part: C2150216; Manufacturer: DIODES(美台); Supplier Footprint: QFN-17-EP(4x4); JLCPCB Part Class: Extended Part; Datasheet: https://atta.szlcsc.com/upload/public/pdf/source/20211207/FAC20C850670BE9A6BDD716467C73C99.pdf; Supplier: LCSC
U9 = AP63203WU-7: Function:Step-down type Output Type:Fixed Input Voltage:3.8V~32V Input Voltage:3.8V~32V Output Voltage:3.3V Output Voltage:3.3V Output Current (Max):2A Switching Frequency:1.1MHz Operating Temperature:-40℃~+85℃@(TA) Operating Temperature:-40℃~+85℃@(TA) Sy; Supplier Part: C780769; Manufacturer: DIODES(美台); Supplier Footprint: TSOT-23-6; JLCPCB Part Class: Extended Part; Datasheet: https://atta.szlcsc.com/upload/public/pdf/source/20210622/C780769_099C67289BD3EC61AAFB52D8B07125B3.pdf; Supplier: LCSC; Function: Step-down type; Output Type: Fixed; Input Voltage: 3.8V~32V; Output Voltage: 3.3V; Output Current (Max): 2A; Switching Frequency: 1.1MHz; Operating Temperature: -40℃~+85℃@(TA); Synchronous Rectification: Yes; Number of Outputs: 1; Topology: Step-down; Switch tube (built-in/external): 内置

## Nets
+3.3V: BRAKE.4 C1.2 C2.2 C3.1 C4.1 C34.2 C35.2 C40.1 C53.1 C55.2 C76.1 C77.2 D2.2(C) D2.5(C) D3.2(A) DEC_TMC.10(VIO) FRAM.2 H2.2 L3.2 LED1.1(A) R6.1 R38.1 R38.2 R39.2 RA_TMC.10(VIO) U1.2(3.3V) U1.74(3.3V) U2.8(VCC) U3.8(VCC) U9.1(FB)
+5V: C15.2 C16.2 C29.1 CN1.4 H1.7 H1.8 L2.2 R36.1 R36.2 R37.2 U7.1(FB)
GND: B1.2 BRAKE.1 C1.1 C2.1 C3.2 C4.2 C15.1 C16.1 C17.1 C18.1 C19.1 C29.2 C30.1 C33.2 C34.1 C35.1 C36.1 C38.1 C39.1 C40.2 C47.2 C53.2 C55.1 C69.2 C70.2 C73.2 C74.2 C75.2 C76.2 C77.1 C78.1 C79.1 C80.2 C81.2 C82.2 C83.2 C84.2 CN1.1 CN2.0 CN2.A1(GND) CN2.A12(GND) CN2.B1(GND) CN2.B12(GND) D1.1(A) D1.4(A) D2.1(A) D2.4(A) D6.2(A) DC1.2 DEC_TMC.9(GND) DEC_TMC.15(GND) H1.1 H1.2 H2.7 IN1.1 JP1.2(GND) JP1.3(GND) LED2.1(K) MX1.1 R3.2 R4.2 R5.1 R9.2 R12.2 R13.2 R14.2 R18.1 R31.1 R32.1 R37.1 R39.1 RA_TMC.9(GND) RA_TMC.15(GND) U1.1(GND) U1.7(GND) U1.33(GND) U1.36(GND) U1.39(GND) U1.45(GND) U1.75(GND) U2.1(GND) U3.1(GND) U3.10(GND) U3.12(GND) U7.4(GND) U8.6(GND) U9.4(GND) U11.1(A0) U11.2(A1) U11.3(A2) U13.1
VBAT: B1.1 R17.2 U1.72(RTC_3V) U3.6(VBAT)
VCC: BRAKE.3 C17.2 C18.2 C19.2 C36.2 C38.2 C39.2 C47.1 C69.1 C70.1 C73.1 C74.1 C75.1 C78.2 C79.2 C80.1 C81.1 C82.1 C83.1 D6.1(K) DEC_TMC.16(VMOT) RA_TMC.16(VMOT) U7.2(EN) U7.3(VIN) U8.15(OUT) U8.16(OUT) U8.17(OUT) U9.2(EN) U9.3(VIN)
D+: CN2.A6(D+) CN2.B6(D+) D1.6(AC) U1.3(USB_D+) U13.2
D-: CN2.A7(D-) CN2.B7(D-) D1.3(AC) U1.5(USB_D-) U13.4
LED: R35.1 U1.62((37))
M1_BMA1: MOT1.3 RA_TMC.12(1A)
M1_BMA2: MOT1.4 RA_TMC.11(1B)
M1_BMB1: MOT1.2 RA_TMC.13(2A)
M1_BMB2: MOT1.1 RA_TMC.14(2B)
M1_CS: RA_TMC.4(CS) U1.55(SPI_/CS (10))
M1_DIR: RA_TMC.8(DIR) U1.51(I2C_SDA1 (25))
M1_ENA: BRAKE.2 RA_TMC.1(EN) U1.53(I2C_SCL1 (24))
M1_ENCA: R1.2 R3.1 U1.47((2))
M1_ENCA_IN: H1.3 R1.1
M1_ENCB: R2.2 R4.1 U1.41(CAN-RX (30))
M1_ENCB_IN: H1.5 R2.1
M1_ENCX: U1.10((4))
M1_M4: RA_TMC.6(M4) U1.65((32))
M1_STEP: RA_TMC.7(STEP) U1.49((22))
M2_BMA1: DEC_TMC.12(1A) MOT2.3
M2_BMA2: DEC_TMC.11(1B) MOT2.4
M2_BMB1: DEC_TMC.13(2A) MOT2.2
M2_BMB2: DEC_TMC.14(2B) MOT2.1
M2_CS: DEC_TMC.4(CS) U1.46((43))
M2_DIR: DEC_TMC.8(DIR) U1.42((41))
M2_ENA: DEC_TMC.1(EN) U1.44((42))
M2_ENCA: R10.2 R13.1 U1.63((33))
M2_ENCA_IN: H1.4 R10.1
M2_ENCB: R11.2 R14.1 U1.43(CAN-TX (31))
M2_ENCB_IN: H1.6 R11.1
M2_ENCX: U1.32((3))
M2_M4: DEC_TMC.6(M4) U1.67((26))
M2_STEP: DEC_TMC.7(STEP) U1.40((40))
MISO: DEC_TMC.5(SDO) RA_TMC.5(SDO) U1.61(SPI_SDI (12))
MOSI: DEC_TMC.2(SDI) RA_TMC.2(SDI) U1.59(SPI_SDO (11))
PPS: U1.18((5)) U3.4(1PPS)
PRG_ESP: H2.3 U1.60((36)) U2.3(IO0)
RST_ESP: H2.4 U1.58((23)) U2.7(RST)
RX_DEBUG: H2.8 U1.56(RX4 (7)) U2.5(TXD)
RX_GPS: U1.20(RX2 (16)) U3.2(TXD)
RX_REMOTE: CN1.2 D2.3(AC) R8.2
SCK: DEC_TMC.3(SCK) RA_TMC.3(SCK) U1.57(SPI_SCK (13))
SCL: R41.1 U1.14(I2C_SCL (19)) U11.6(SCL)
SCLG: U3.17(SCL)
SDA: R40.2 U1.12(I2C_SDA (18)) U11.5(SDA)
SDAG: U3.16(SDA)
TX_DEBUG: H2.1 U1.54(TX4 (8)) U2.4(RXD)
TX_GPS: U1.22(TX2 (17)) U3.3(RXD)
TX_REMOTE: CN1.3 D2.6(AC) R6.2 R7.2
VUSB_IN: CN2.A4(VBUS) CN2.A9(VBUS) CN2.B4(VBUS) CN2.B9(VBUS) D1.2(C) D1.5(C) U1.9(USB_VIN) U13.3
$1N74185: R8.1 U1.19(RX1 (0))
$1N74186: R7.1 U1.17(TX1 (1))
$1N92540: L1.1 U3.14(VCC_RF)
$1N104745: CN2.B5(CC2) R5.2
$1N104749: CN2.A5(CC1) R9.1
$1N106279: LED2.2(A) R35.2
$1N106286: LED1.2(C) R12.1
$1N143386: JP1.1(SIG) L1.2 U3.11(RF_IN)
$1N173382: C84.1 FRAM.1 R40.1 R41.2 U11.8(VDD)
$3N2384: D3.1(K) R17.1
$3N2780: C13.2 L2.1 U7.5(SW)
$3N23825: C13.1 U7.6(BST)
$3N39858: PS1.5(Comm) R18.2 U8.4(EN)
$3N39869: DC1.1 IN1.2 PS1.4(On) U8.1(IN) U8.2(IN) U8.3(IN)
$3N39927: PS1.1(Meca) PS1.2(Meca)
$3N39977: C30.2 U8.7(VREG)
$3N40219: R32.2 U8.14(VLIM)
$3N40264: C33.1 U8.12(DV/DT)
$3N40420: R31.2 U8.13(ILIM)
$3N44061: C37.2 L3.1 U9.5(SW)
$3N44065: C37.1 U9.6(BST)

Not connected (* = marked no-connect by the designer): CN1 5*; CN2 A2(TX1+)* A3(TX1-)* A8(SBU1)* A10(RX2-)* A11(RX2+)* B2(TX2+)* B3(TX2-)* B8(SBU2)* B10(RX1-)* B11(RX1+)*; DC1 3*; H2 5* 6*; PS1 6(On)*; R42 1 2; U1 4((28))* 6(ON/OFF)* 8((27))* 11(/Program)* 13((X))* 15((X))* 16((29))* 21((X))* 23((X))* 34(TX3 (14))* 35((X))* 37((X))* 38(RX3 (15))* 48((44))* 50(RX5(21))* 52(TX5(20))* 64((35))* 66((34))* 68((38))* 69((9))* 70((39))* 71((6))* 73((45))*; U2 2(IO2)* 6(EN)*; U3 5(ON/OFF)* 7(NC)* 9(NRESET)* 13(NC)* 15(Reserved)* 18(Reserved)*; U8 5(FRS)* 8(DISC1)* 9(DISC2)* 10(FAULTB)* 11(IMON)* 18(SRC)*; U11 4(VSS) 7(WP)*; U12 1(GND) 2(TXD) 3(RXD) 4(1PPS) 5(ON/OFF)* 6(VBAT) 7(NC)* 8(VCC) 9(NRESET)* 10(GND) 11(RF_IN) 12(GND) 13(NC)* 14(VCC_RF) 15(Reserved)* 16(SDA)* 17(SCL)* 18(Reserved)*

## Notes on the sheets
sheet 1
- Teensy
- SHC remote
- USB
- Encoders
- LEDs
- Debug / Wifi
- ESD protection
- GPS
sheet 2
- Motor 1 (RA/ AZ)
- Power reverse protection (25V max)
- Battery
- 30V -> 3V3 Step Down
- Motor 2 (DEC / ALT)
- 30V -> 5V Step Down
